# Altium project DVT-Levelshifert-HT.PrjPcb
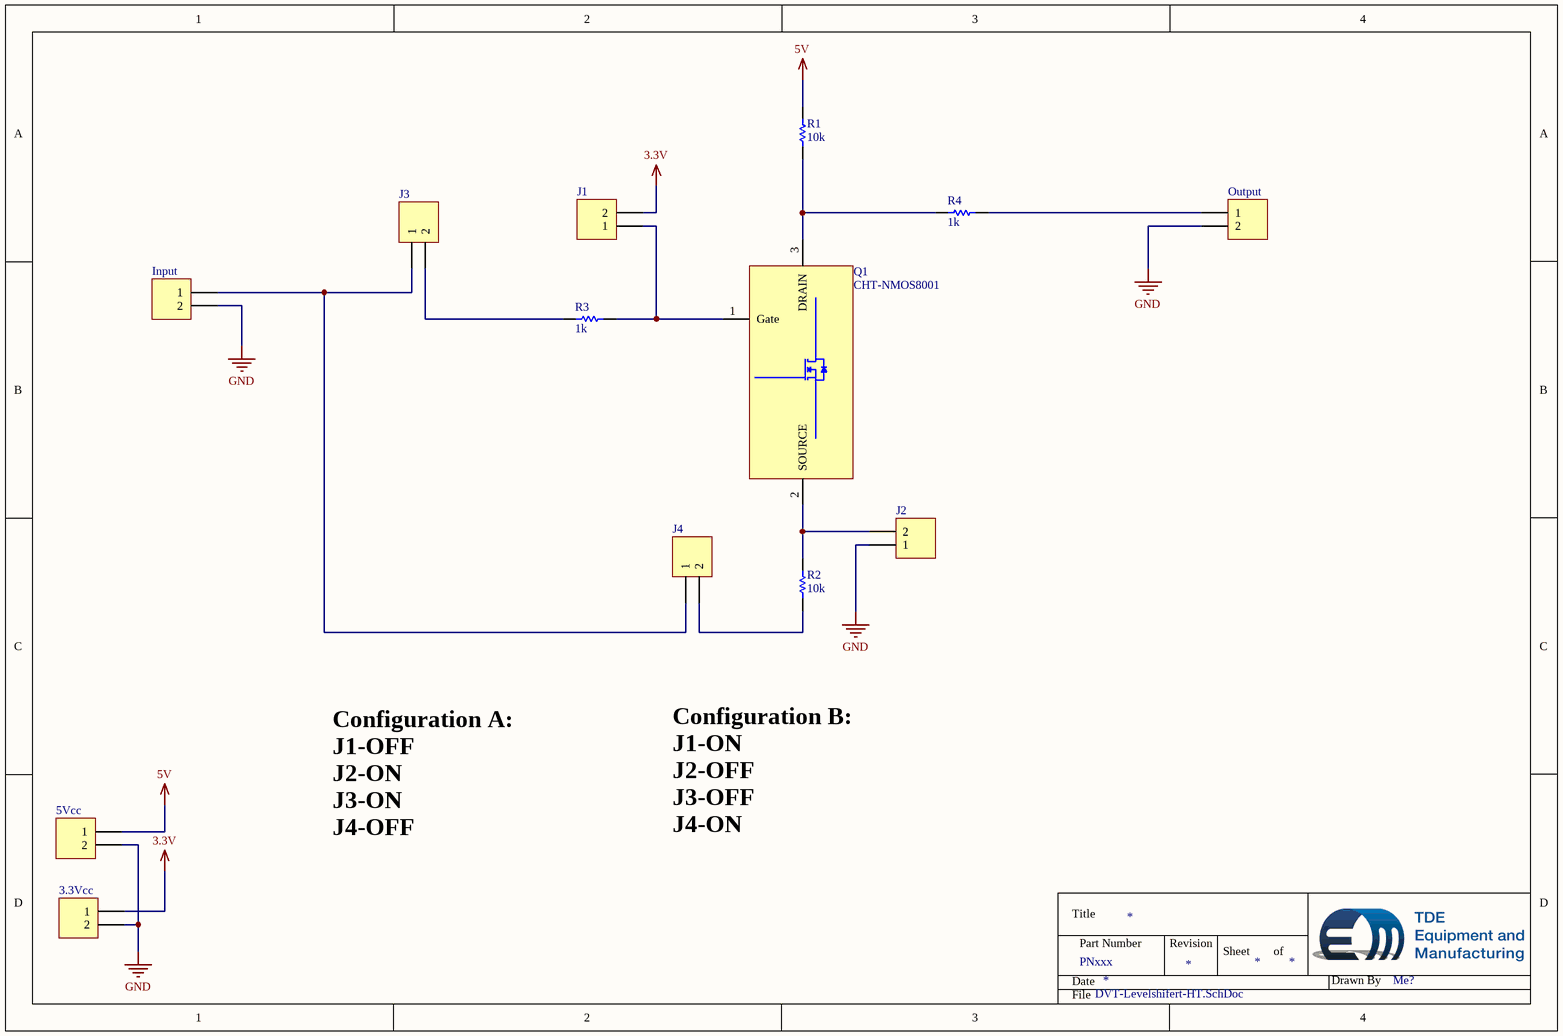
[diagram p0: DVT-Levelshifert-HT.SchDoc]
1 sheet, 13 parts. Net scope: global (net labels, ports and power ports of the same name join across sheets).
Board file: DVT-Levelshifert-HT.PcbDoc

## Sheet DVT-Levelshifert-HT.SchDoc
size A4; PartNumber: PNxxx; Drawn By: Me?

### Parts
3.3Vcc  PHOENIX_1715721  [Phoenix-2-5_08]  (value not drawn)
5Vcc  PHOENIX_1715721  [Phoenix-2-5_08]  (value not drawn)
Input  PHOENIX_1715721  [Phoenix-2-5_08]  (value not drawn)
J1  PHOENIX_1715721  [HDR1X2]  (value not drawn)
J2  PHOENIX_1715721  [HDR1X2]  (value not drawn)
J3  PHOENIX_1715721  [HDR1X2]  (value not drawn)
J4  PHOENIX_1715721  [HDR1X2]  (value not drawn)
Output  PHOENIX_1715721  [Phoenix-2-5_08]  (value not drawn)
Q1  CHT-NMOS8001  [TDFP16 - NMOS8001]
R1  value 10k  [Dummy-10mm]  (hidden comment: Resistor-Dummy-THT)
R2  value 10k  [Dummy-10mm]  (hidden comment: Resistor-Dummy-THT)
R3  value 1k  [Dummy-10mm]  (hidden comment: Resistor-Dummy-THT)
R4  value 1k  [Dummy-10mm]  (hidden comment: Resistor-Dummy-THT)

### Nets
3.3V: 3.3Vcc.1 J1.2
5V: 5Vcc.1 R1.2
GND: 3.3Vcc.2 5Vcc.2 Input.2 J2.1 Output.2
NetInput_1: Input.1 J3.1 J4.1
NetJ1_1: J1.1 Q1.1(Gate) R3.1
NetJ2_2: J2.2 Q1.2(SOURCE) R2.2
NetJ3_2: J3.2 R3.2
NetJ4_2: J4.2 R2.1
NetOutput_1: Output.1 R4.1
NetQ1_3: Q1.3(DRAIN) R1.1 R4.2

### Notes on the sheet
- Configuration A:
  J1-OFF
  J2-ON
  J3-ON
  J4-OFF
- Configuration B:
  J1-ON
  J2-OFF
  J3-OFF
  J4-ON
- Title
- Date
- Part Number
- Revision
- Sheet
- of
- Drawn By
- File

### Library data of the parts
3.3Vcc 5Vcc Input Output = 2Pol_1715721: Phoenix, 2 pol, 5.08mm, 22A, 715721; Deliverer PartNr: 193-0564; Deliverer: RS; TDE-PN: CON0008; LatestRevisionDate: 02.05.2014; LatestRevisionNote: Re-released for DXP Platform.; Publisher: Sebastian Kulik; Manufacturer PartNr: 1715721; Manufacturer: Phoenix; PackageDescription: Phoenix-2-5_08; Price: 0.976/5
J1-J4 = Plug_2_90_2.54: Plug, 2-Pin; Manufacturer PartNr: 61300211021; Manufacturer: WE; Deliverer PartNr: 2356176; Deliverer: Farnell; TDE-PN: CON0010; LatestRevisionDate: 14.05.2014; LatestRevisionNote: Re-released for DXP Platform.; Publisher: Sebastian Kulik
Q1 = CHT-NMOS8001: Comparator, Hi-Temp, 25MHz; Deliverer: CISSOID; TDE-PN: DIS0052; Published: 13.09.2016; Deliverer PartNr: CHT-NMOS8001; PackageDescription: DIP16; Publisher: Sebastian Kulik; Manufacturer PartNr: CHT-NMOS8001; Manufacturer: CISSOID; Price: 204.93/5
R1 R2 = Resistor-Dummy-THT: Deliverer PartNr: 830-7447; Deliverer: RS; Published: 08.12.2015; Publisher: Sebastian Kulik; PackageDescription: -; Manufacturer: -; Manufacturer PartNr: -; TDE-PN: -; Part Desicription: Resistor-Dummy-THT; Price: 0.09/1
R3 R4 = Resistor-Dummy-THT: Deliverer PartNr: 830-6794; Deliverer: RS; Published: 08.12.2015; Publisher: Sebastian Kulik; PackageDescription: -; Manufacturer: -; Manufacturer PartNr: -; TDE-PN: -; Part Desicription: Resistor-Dummy-THT; Price: 0.14/1